# EAGLE design display (EAGLE 6.5.0)
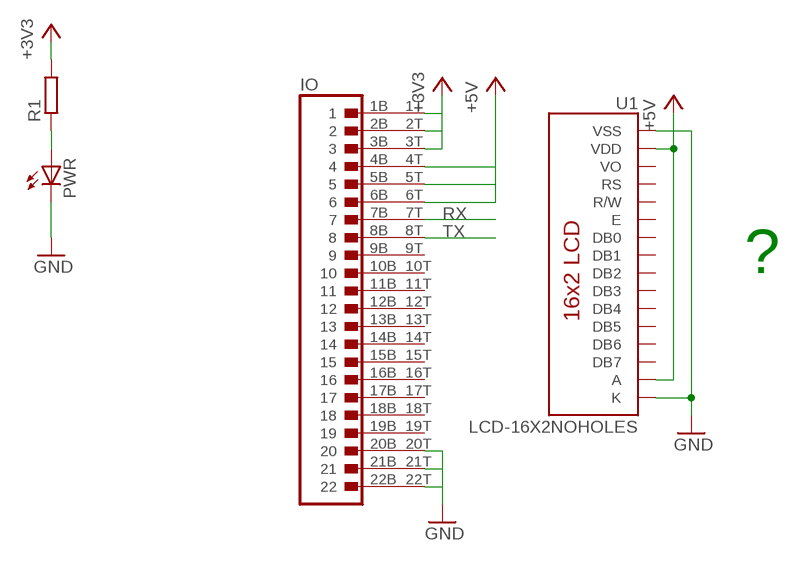
[diagram p0: schematic, sheet 1]

## Parts
IO  SIMBRD22  [SIMBRD22]
PWR  LED1206  [LED-1206]
R1  R-EU_R0805  [R0805]
U1  LCD-16X2NOHOLES  [LCD-16X2_NOHOLES]

## Nets
+3V3: IO.1T(A1) IO.2T(A2) IO.3T(A3) R1.2
+5V: IO.4T(A4) IO.5T(A5) IO.6T(A6) U1.2(VDD) U1.15(A)
GND: IO.20T(A20) IO.21T(A21) IO.22T(A22) PWR.C U1.1(VSS) U1.16(K)
N$1: PWR.A R1.1
RX: IO.7T(A7)
TX: IO.8T(A8)
Unconnected: IO.1B IO.2B IO.3B IO.4B IO.5B IO.6B IO.7B IO.8B IO.9B IO.9T(A9) IO.10B IO.10T(A10) IO.11B IO.11T(A11) IO.12B IO.12T(A12) IO.13B IO.13T(A13) IO.14B IO.14T(A14) IO.15B IO.15T(A15) IO.16B IO.16T(A16) IO.17B IO.17T(A17) IO.18B IO.18T(A18) IO.19B IO.19T(A19) IO.20B IO.21B IO.22B U1.3(VO) U1.4(RS) U1.5(R/W) U1.6(E) U1.7(DB0) U1.8(DB1) U1.9(DB2) U1.10(DB3) U1.11(DB4) U1.12(DB5) U1.13(DB6) U1.14(DB7)

## Notes on the sheet
- ?

## Library data of the parts
IO = con-amp:SIMBRD22: AMP connector
PWR = SparkFun-LED:LED: LEDs Standard schematic elements and footprints for 5mm, 3mm, 1206, and 0603 sized LEDs. 5mm - Spark Fun Electronics SKU : COM-00529 (and others)
R1 = rcl:R-EU_: RESISTOR, European symbol
U1 = SparkFun-Displays:LCD-16X2: Standard text-only 16x2 parallel input LCD

## Board
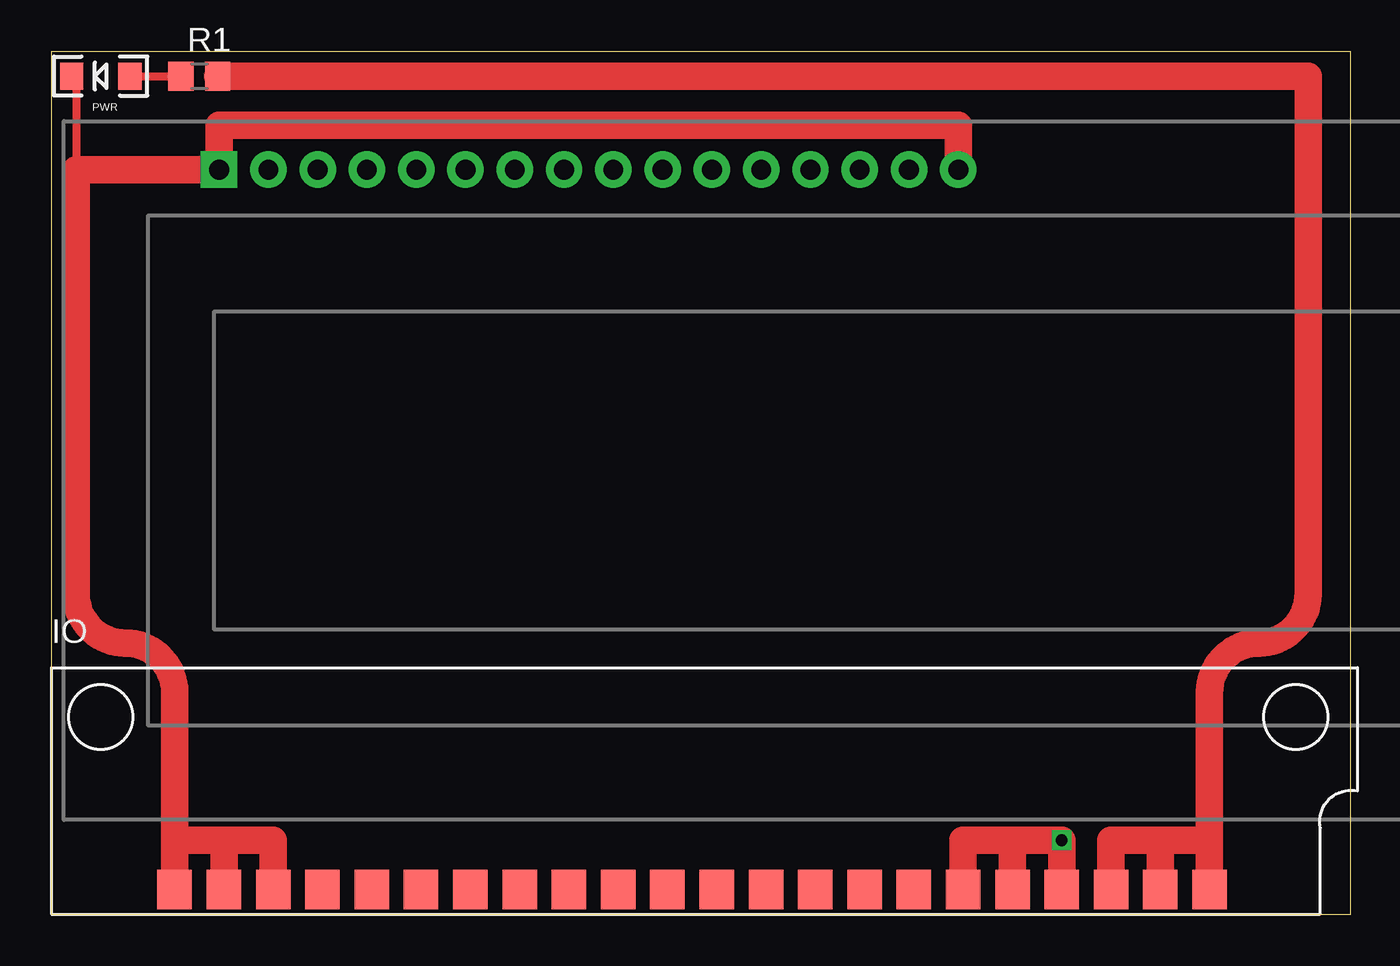
[diagram p1: board, top side]
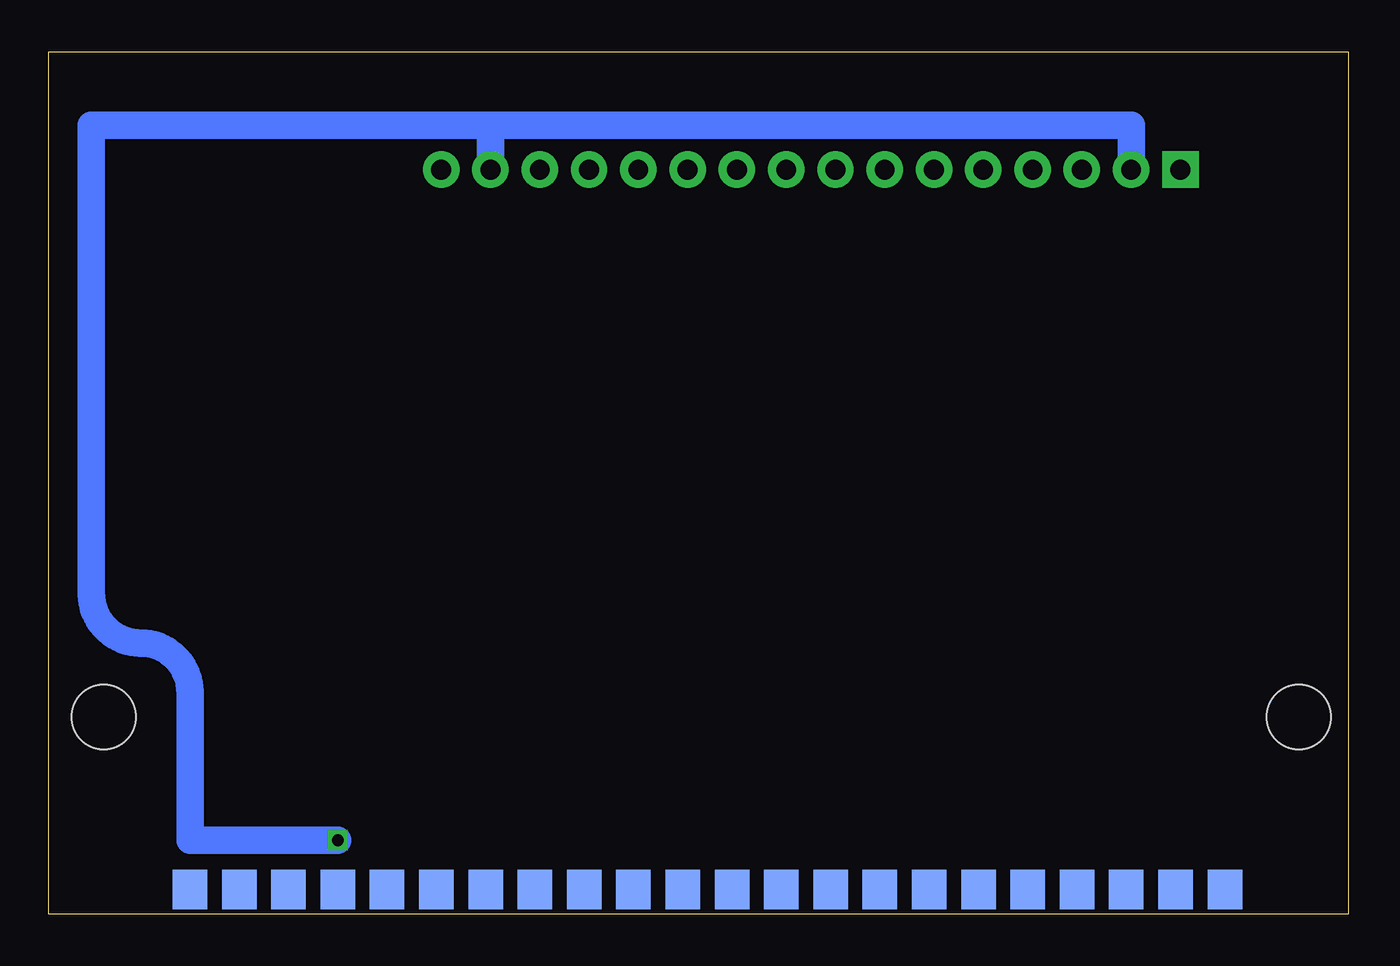
[diagram p2: board, bottom side, seen from below]

Size 66.98 x 44.44 mm. Coordinates in mm from the lower left corner, seen from the top.
Outline: 0,0 66.98,0 66.98,44.44 0,44.44 0,0
Copper layers (1*16): Top 0.035mm / dielectric 1.5mm / Bottom 0.035mm
Design rules "default": minimum track width 10mil, minimum drill 24mil, track to track 8mil, track to pad 8mil, pad to pad 8mil, via to via 8mil, smd to smd 8mil, copper to edge 40mil, drill to drill 8mil, minimum pad ring 10mil, minimum via ring 8mil, stop-mask expansion 4mil, vias tented up to drill 0mil, thermal gap 10mil

### Footprints (pad centres in the part's own frame; a part is rotated, then mirrored left to right if it is on the bottom)
SIMBRD22 = smd 1.778 x 2.032 bottom: 1B 26.67,-6.35; 2B 24.13,-6.35; 3B 21.59,-6.35; 4B 19.05,-6.35; 5B 16.51,-6.35; 6B 13.97,-6.35; 7B 11.43,-6.35; 8B 8.89,-6.35; 9B 6.35,-6.35; 10B 3.81,-6.35; 11B 1.27,-6.35; 12B -1.27,-6.35; 13B -3.81,-6.35; 14B -6.35,-6.35; 15B -8.89,-6.35; 16B -11.43,-6.35; 17B -13.97,-6.35; 18B -16.51,-6.35; 19B -19.05,-6.35; 20B -21.59,-6.35; 21B -24.13,-6.35; 22B -26.67,-6.35 | smd 1.778 x 2.032: 1T 26.67,-6.35; 2T 24.13,-6.35; 3T 21.59,-6.35; 4T 19.05,-6.35; 5T 16.51,-6.35; 6T 13.97,-6.35; 7T 11.43,-6.35; 8T 8.89,-6.35; 9T 6.35,-6.35; 10T 3.81,-6.35; 11T 1.27,-6.35; 12T -1.27,-6.35; 13T -3.81,-6.35; 14T -6.35,-6.35; 15T -8.89,-6.35; 16T -11.43,-6.35; 17T -13.97,-6.35; 18T -16.51,-6.35; 19T -19.05,-6.35; 20T -21.59,-6.35; 21T -24.13,-6.35; 22T -26.67,-6.35 | hole 3.302: -30.48,2.54; 31.115,2.54
LED-1206 = smd 1.2 x 1.4: A -1.5,0; C 1.5,0
R0805 = smd 1.3 x 1.5: 1 -0.95,0; 2 0.95,0
LCD-16X2_NOHOLES = drill 1.016 pad 1.88 square: 1 -32,15.5 | drill 1.016 pad 1.88: 2 -29.46,15.5; 3 -26.92,15.5; 4 -24.38,15.5; 5 -21.84,15.5; 6 -19.3,15.5; 7 -16.76,15.5; 8 -14.22,15.5; 9 -11.68,15.5; 10 -9.14,15.5; 11 -6.6,15.5; 12 -4.06,15.5; 13 -1.52,15.5; 14 1.02,15.5; 15 3.56,15.5; 16 6.1,15.5

### Placement (x,y rotation side)
IO  33.02,7.62 0 top
PWR  2.54,43.18 180 top
R1  7.62,43.18 0 top
U1  40.64,22.86 0 top

### Tracks (layer width: path | path; a pad name or v marks a point on that pad's centre or on a via)
+3V3
  Top 1.422: IO.3T 54.61,3.81 57.15,3.81 | 59.69,3.81 IO.1T | IO.2T 57.15,3.81 | 57.15,3.81 59.69,3.81 | 59.69,3.81 59.69,11.43 arc-90 62.23,13.97 arc90 64.77,16.51 64.77,43.18 R1.2
+5V  (via drill 0.6)
  Top 1.422: IO.6T 46.99,3.81 49.53,3.81 | 49.53,3.81 IO.5T | IO.4T v52.07,3.81 49.53,3.81
  Bottom 1.422: U1.15 44.2,40.64 | 44.2,40.64 11.18,40.64 U1.2 | v52.07,3.81 59.69,3.81 59.69,11.43 arc-90 62.23,13.97 arc90 64.77,16.51 64.77,40.64 44.2,40.64
GND
  Top 0.406: PWR.C 1.27,43.18 1.27,38.1
  Top 1.422: IO.20T 11.43,3.81 8.89,3.81 | 6.35,3.81 IO.22T | IO.21T 8.89,3.81 | 8.89,3.81 6.35,3.81 | 6.35,3.81 6.35,11.43 arc90 3.81,13.97 arc-90 1.27,16.51 1.27,38.1 1.27,38.36 U1.1 8.64,40.64 46.74,40.64 U1.16
N$1
  Top 0.406: PWR.A R1.1